# Altium schematic sheet Bus.SchDoc
size 420 x 297 mm; Address1: Address1; Address2: Address2; Address3: Address3; Address4: Address4; DocumentNumber: *Э*; SheetNumber: 2; SheetTotal: 12; DocumentType: Схема электрическая *
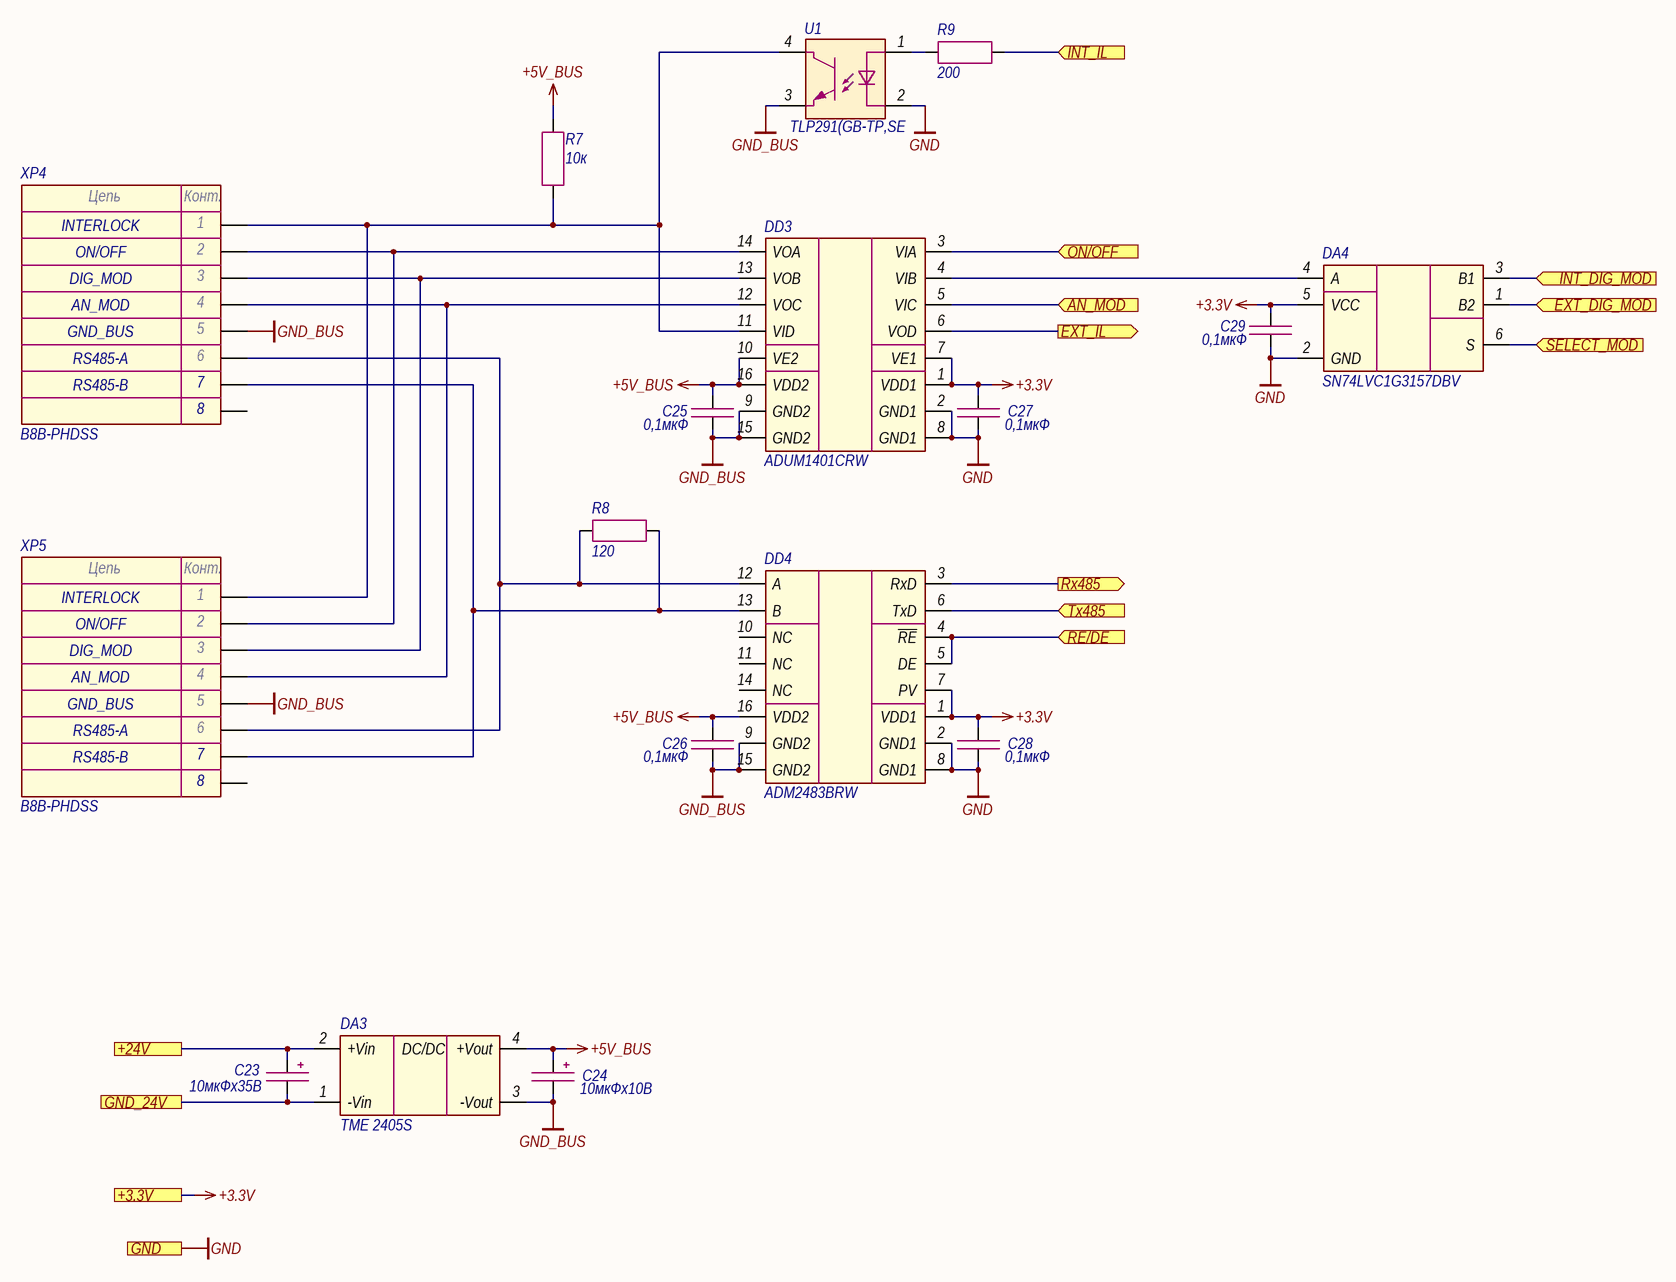
[diagram p0: Bus.SchDoc]

## Parts
C23  10мкФх35B  [CAP_C]
C24  10мкФх10B  [CAP_A]
C25  0,1мкФ  [CAP_0603]
C26  0,1мкФ  [CAP_0603]
C27  0,1мкФ  [CAP_0603]
C28  0,1мкФ  [CAP_0603]
C29  0,1мкФ  [CAP_0603]
DA3  TME 2405S  [TME (SIP-4)]
DA4  SN74LVC1G3157DBV  [SOT-23-6]
DD3  ADUM1401CRW  [SOIC-16W]
DD4  ADM2483BRW  [SOIC-16W]
R7  10к  [RES_0603]
R8  120  [RES_0805]
R9  200  [RES_0603]
U1  TLP291(GB-TP,SE  [11-3C1]
XP4  B8B-PHDSS  [B8B-PHDSS]
XP5  B8B-PHDSS  [B8B-PHDSS]

## Ports
+3.3V (see Main[1A], Button[1D], Ethernet[3D], Fiber_interlock[2C], Flow_sensor[2C], Hardwiring[3D]), +24V (see Main[1A], Button[1C], Column[1C], Flow_sensor[2C], Hardwiring[3C], Indication[1C]), AN_MOD (in, see Main[2A]), EXT_DIG_MOD (in, see Main[2A]), EXT_IL (out, see Main[2A]), GND (see Main[1A], Button[1D], Column[1C], Ethernet[3D], Fiber_interlock[2C], Flow_sensor[2C], Guide_laser[1C], Hardwiring[3D], Indication[1C]), GND_24V (see Main[1A], Button[1D], Column[1C], Flow_sensor[2C], Hardwiring[3C], Indication[1C]), INT_DIG_MOD (in, see Main[2A]), INT_IL (in, see Main[2A]), ON/OFF (in, see Main[2A]), RE/DE (in, see Main[1A]), Rx485 (out, see Main[1A]), SELECT_MOD (in, see Main[2A]), Tx485 (in, see Main[1A])

## Nets
+3.3V: C27.1 C28.1 C29.1 DA4.5(VCC) DD3.1(VDD1) DD3.7(VE1) DD4.1(VDD1) DD4.7(PV) ; port +3.3V
+5V_BUS: C24.1 C25.1 C26.1 DA3.4(+Vout) DD3.10(VE2) DD3.16(VDD2) DD4.16(VDD2) R7.1
GND: C27.2 C28.2 C29.2 DA4.2(GND) DD3.2(GND1) DD3.8(GND1) DD4.2(GND1) DD4.8(GND1) U1.2 ; port GND
GND_BUS: C24.2 C25.2 C26.2 DA3.3(-Vout) DD3.9(GND2) DD3.15(GND2) DD4.9(GND2) DD4.15(GND2) U1.3 XP4.5 XP5.5
+24V: C23.1 DA3.2(+Vin) ; port +24V
AN_MOD: DD3.5(VIC) ; port AN_MOD
EXT_DIG_MOD: DA4.1(B2) ; port EXT_DIG_MOD
EXT_IL: DD3.6(VOD) ; port EXT_IL
GND_24V: C23.2 DA3.1(-Vin) ; port GND_24V
INT_DIG_MOD: DA4.3(B1) ; port INT_DIG_MOD
INT_IL: R9.1 ; port INT_IL
ON/OFF: DD3.3(VIA) ; port ON/OFF
RE/DE: DD4.4(~{RE}) DD4.5(DE) ; port RE/DE
Rx485: DD4.3(RxD) ; port Rx485
SELECT_MOD: DA4.6(S) ; port SELECT_MOD
Tx485: DD4.6(TxD) ; port Tx485
NetDA4_4: DA4.4(A) DD3.4(VIB)
NetDD3_11: DD3.11(VID) R7.2 U1.4 XP4.1 XP5.1
NetDD3_12: DD3.12(VOC) XP4.4 XP5.4
NetDD3_13: DD3.13(VOB) XP4.3 XP5.3
NetDD3_14: DD3.14(VOA) XP4.2 XP5.2
NetDD4_12: DD4.12(A) R8.1 XP4.6 XP5.6
NetDD4_13: DD4.13(B) R8.2 XP4.7 XP5.7
NetR9_2: R9.2 U1.1

Not connected (* = marked no-connect by the designer): DD4 10(NC) 11(NC) 14(NC); XP4 8; XP5 8

## Notes on the sheet
- INTERLOCK
- DIG_MOD
- ON/OFF
- AN_MOD
- RS485-A
- GND_BUS
- RS485-B
- Подп. и дата
- Инв. № дубл.
- Взам. инв. №
- Инв. № подл.
- Изм.
- Лист
- № докум.
- Подп.
- Дата
- Копировал
- Формат А3
- (in symbol Connector-8) Цепь; Конт.
- (in symbol TME) DC/DC

## Library data of the parts
C23 = Capacitor_Polar: Model: TECAP, 10 мкФ, 35 В, тип C, 10%; Value: 10мкФх35B; Document: *; Manufacturer: *
C24 = Capacitor_Polar: Model: TECAP, 10 мкФ, 10 В, тип A, 10%; Value: 10мкФх10B; Document: *; Manufacturer: *
C25-C29 = Capacitor: Manufacturer: Murata; Model: GRM188R71H104KA93D; Value: 0,1мкФ; Document: *
DA3 = TME: Manufacturer: Traco Power; Model: TME 2405S; Document: *
DA4 = SN74LVC1G3157: Manufacturer: Texas Instruments; Model: SN74LVC1G3157DBV; Document: *
DD3 = ADUM1401: Manufacturer: Analog Devices; Model: ADUM1401CRW; Document: *
DD4 = ADM2483BRW: Manufacturer: Analog Devices; Model: ADM2483BRW; Document: *
R7 = Resistor: Manufacturer: Yageo; Model: RC0603FR-0710KL; Value: 10к; Document: *
R8 = Resistor: Manufacturer: Yageo; Model: RC0805FR-07120RL; Value: 120; Document: *
R9 = Resistor: Manufacturer: Yageo; Model: RC0603FR-07200RL; Value: 200; Document: *
U1 = TLP291: Manufacturer: Toshiba; Model: TLP291(GB-TP,SE; Document: *
XP4 XP5 = Connector-8: Manufacturer: JST; Model: B8B-PHDSS; Document: *